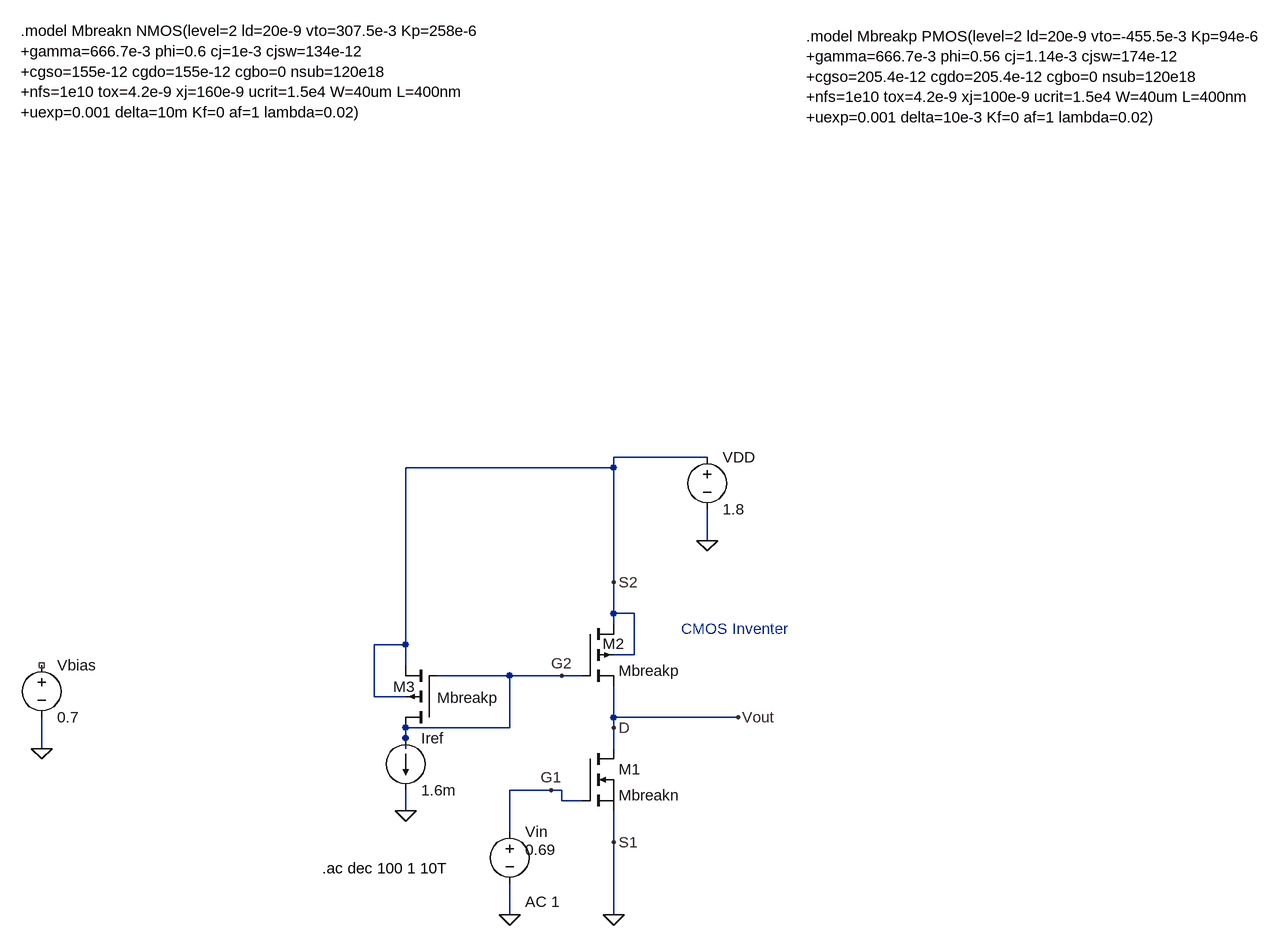
[diagram p0: schematic CMOS-Inveneter.asc]
CMOS-Inveneter.asc, the LTspice schematic file:
Version 4
SHEET 1 1744 680
WIRE 816 -256 672 -256
WIRE 672 -240 672 -256
WIRE 672 -240 352 -240
WIRE 816 -128 816 -176
WIRE 672 -64 672 -240
WIRE 672 -16 672 -64
WIRE 704 -16 672 -16
WIRE 672 0 672 -16
WIRE 352 32 352 -240
WIRE 352 32 304 32
WIRE 704 48 704 -16
WIRE 704 48 672 48
WIRE 352 64 352 32
WIRE 512 80 400 80
WIRE 592 80 512 80
WIRE 624 80 592 80
WIRE 304 112 304 32
WIRE 352 112 304 112
WIRE 672 144 672 96
WIRE 864 144 672 144
WIRE 512 160 512 80
WIRE 512 160 352 160
WIRE 672 160 672 144
WIRE 352 176 352 160
WIRE -208 192 -208 144
WIRE 352 192 352 176
WIRE 672 192 672 160
WIRE 576 256 512 256
WIRE 592 256 576 256
WIRE 592 272 592 256
WIRE 624 272 592 272
WIRE 352 288 352 256
WIRE 512 320 512 256
WIRE 672 336 672 288
WIRE 512 448 512 400
WIRE 672 448 672 336
FLAG -208 192 0
FLAG 816 -128 0
FLAG 672 336 S1
FLAG 672 160 D
FLAG 592 80 G2
FLAG 672 -64 S2
FLAG 864 144 Vout
FLAG 512 448 0
FLAG 672 448 0
FLAG 352 288 0
FLAG 576 256 G1
SYMBOL nmos 624 192 R0
SYMATTR InstName M1
SYMATTR Value Mbreakn
SYMBOL voltage -208 48 R0
WINDOW 123 0 0 Left 0
WINDOW 39 0 0 Left 0
SYMATTR InstName Vbias
SYMATTR Value 0.7
SYMBOL voltage 816 -272 R0
WINDOW 123 24 44 Left 2
WINDOW 39 0 0 Left 0
SYMATTR InstName VDD
SYMATTR Value 1.8
SYMBOL voltage 512 304 R0
WINDOW 123 24 124 Left 2
WINDOW 39 0 0 Left 0
WINDOW 3 24 44 Left 2
SYMATTR Value2 AC 1
SYMATTR Value 0.69
SYMATTR InstName Vin
SYMBOL pmos4 624 0 R0
WINDOW 0 31 31 Left 2
SYMATTR InstName M2
SYMATTR Value Mbreakp
SYMBOL pmos4 400 160 R180
WINDOW 0 33 63 Left 2
WINDOW 3 -95 46 Left 2
SYMATTR InstName M3
SYMATTR Value Mbreakp
SYMBOL current 352 176 R0
WINDOW 123 24 108 Left 2
WINDOW 39 0 0 Left 0
SYMATTR InstName Iref
SYMATTR Value 1.6m
TEXT 776 8 Left 2 ;CMOS Inventer
TEXT 968 -904 Left 2 !.model Mbreakp PMOS(level=2 ld=20e-9 vto=-455.5e-3 Kp=94e-6\n+gamma=666.7e-3 phi=0.56 cj=1.14e-3 cjsw=174e-12\n+cgso=205.4e-12 cgdo=205.4e-12 cgbo=0 nsub=120e18\n+nfs=1e10 tox=4.2e-9 xj=100e-9 ucrit=1.5e4 W=40um L=400nm\n+uexp=0.001 delta=10e-3 Kf=0 af=1 lambda=0.02)
TEXT -240 -912 Left 2 !.model Mbreakn NMOS(level=2 ld=20e-9 vto=307.5e-3 Kp=258e-6\n+gamma=666.7e-3 phi=0.6 cj=1e-3 cjsw=134e-12\n+cgso=155e-12 cgdo=155e-12 cgbo=0 nsub=120e18\n+nfs=1e10 tox=4.2e-9 xj=160e-9 ucrit=1.5e4 W=40um L=400nm\n+uexp=0.001 delta=10m Kf=0 af=1 lambda=0.02)
TEXT 224 376 Left 2 !.ac dec 100 1 10T

The netlist it stands for:
* CMOS-Inveneter.asc
M1 Vout G1 0 0 Mbreakn
Vbias NC_01 0 0.7
VDD S2 0 1.8
Vin G1 0 0.69 AC 1
M2 S2 G2 Vout S2 Mbreakp
M3 G2 G2 S2 S2 Mbreakp
Iref G2 0 1.6m
.model NMOS NMOS
.model PMOS PMOS
.lib standard.mos
* CMOS Inventer
.model Mbreakp PMOS(level=2 ld=20e-9 vto=-455.5e-3 Kp=94e-6
+gamma=666.7e-3 phi=0.56 cj=1.14e-3 cjsw=174e-12
+cgso=205.4e-12 cgdo=205.4e-12 cgbo=0 nsub=120e18
+nfs=1e10 tox=4.2e-9 xj=100e-9 ucrit=1.5e4 W=40um L=400nm
+uexp=0.001 delta=10e-3 Kf=0 af=1 lambda=0.02)
.model Mbreakn NMOS(level=2 ld=20e-9 vto=307.5e-3 Kp=258e-6
+gamma=666.7e-3 phi=0.6 cj=1e-3 cjsw=134e-12
+cgso=155e-12 cgdo=155e-12 cgbo=0 nsub=120e18
+nfs=1e10 tox=4.2e-9 xj=160e-9 ucrit=1.5e4 W=40um L=400nm
+uexp=0.001 delta=10m Kf=0 af=1 lambda=0.02)
.ac dec 100 1 10T
.backanno
.end